# Altium project uStepperS.PrjPcb
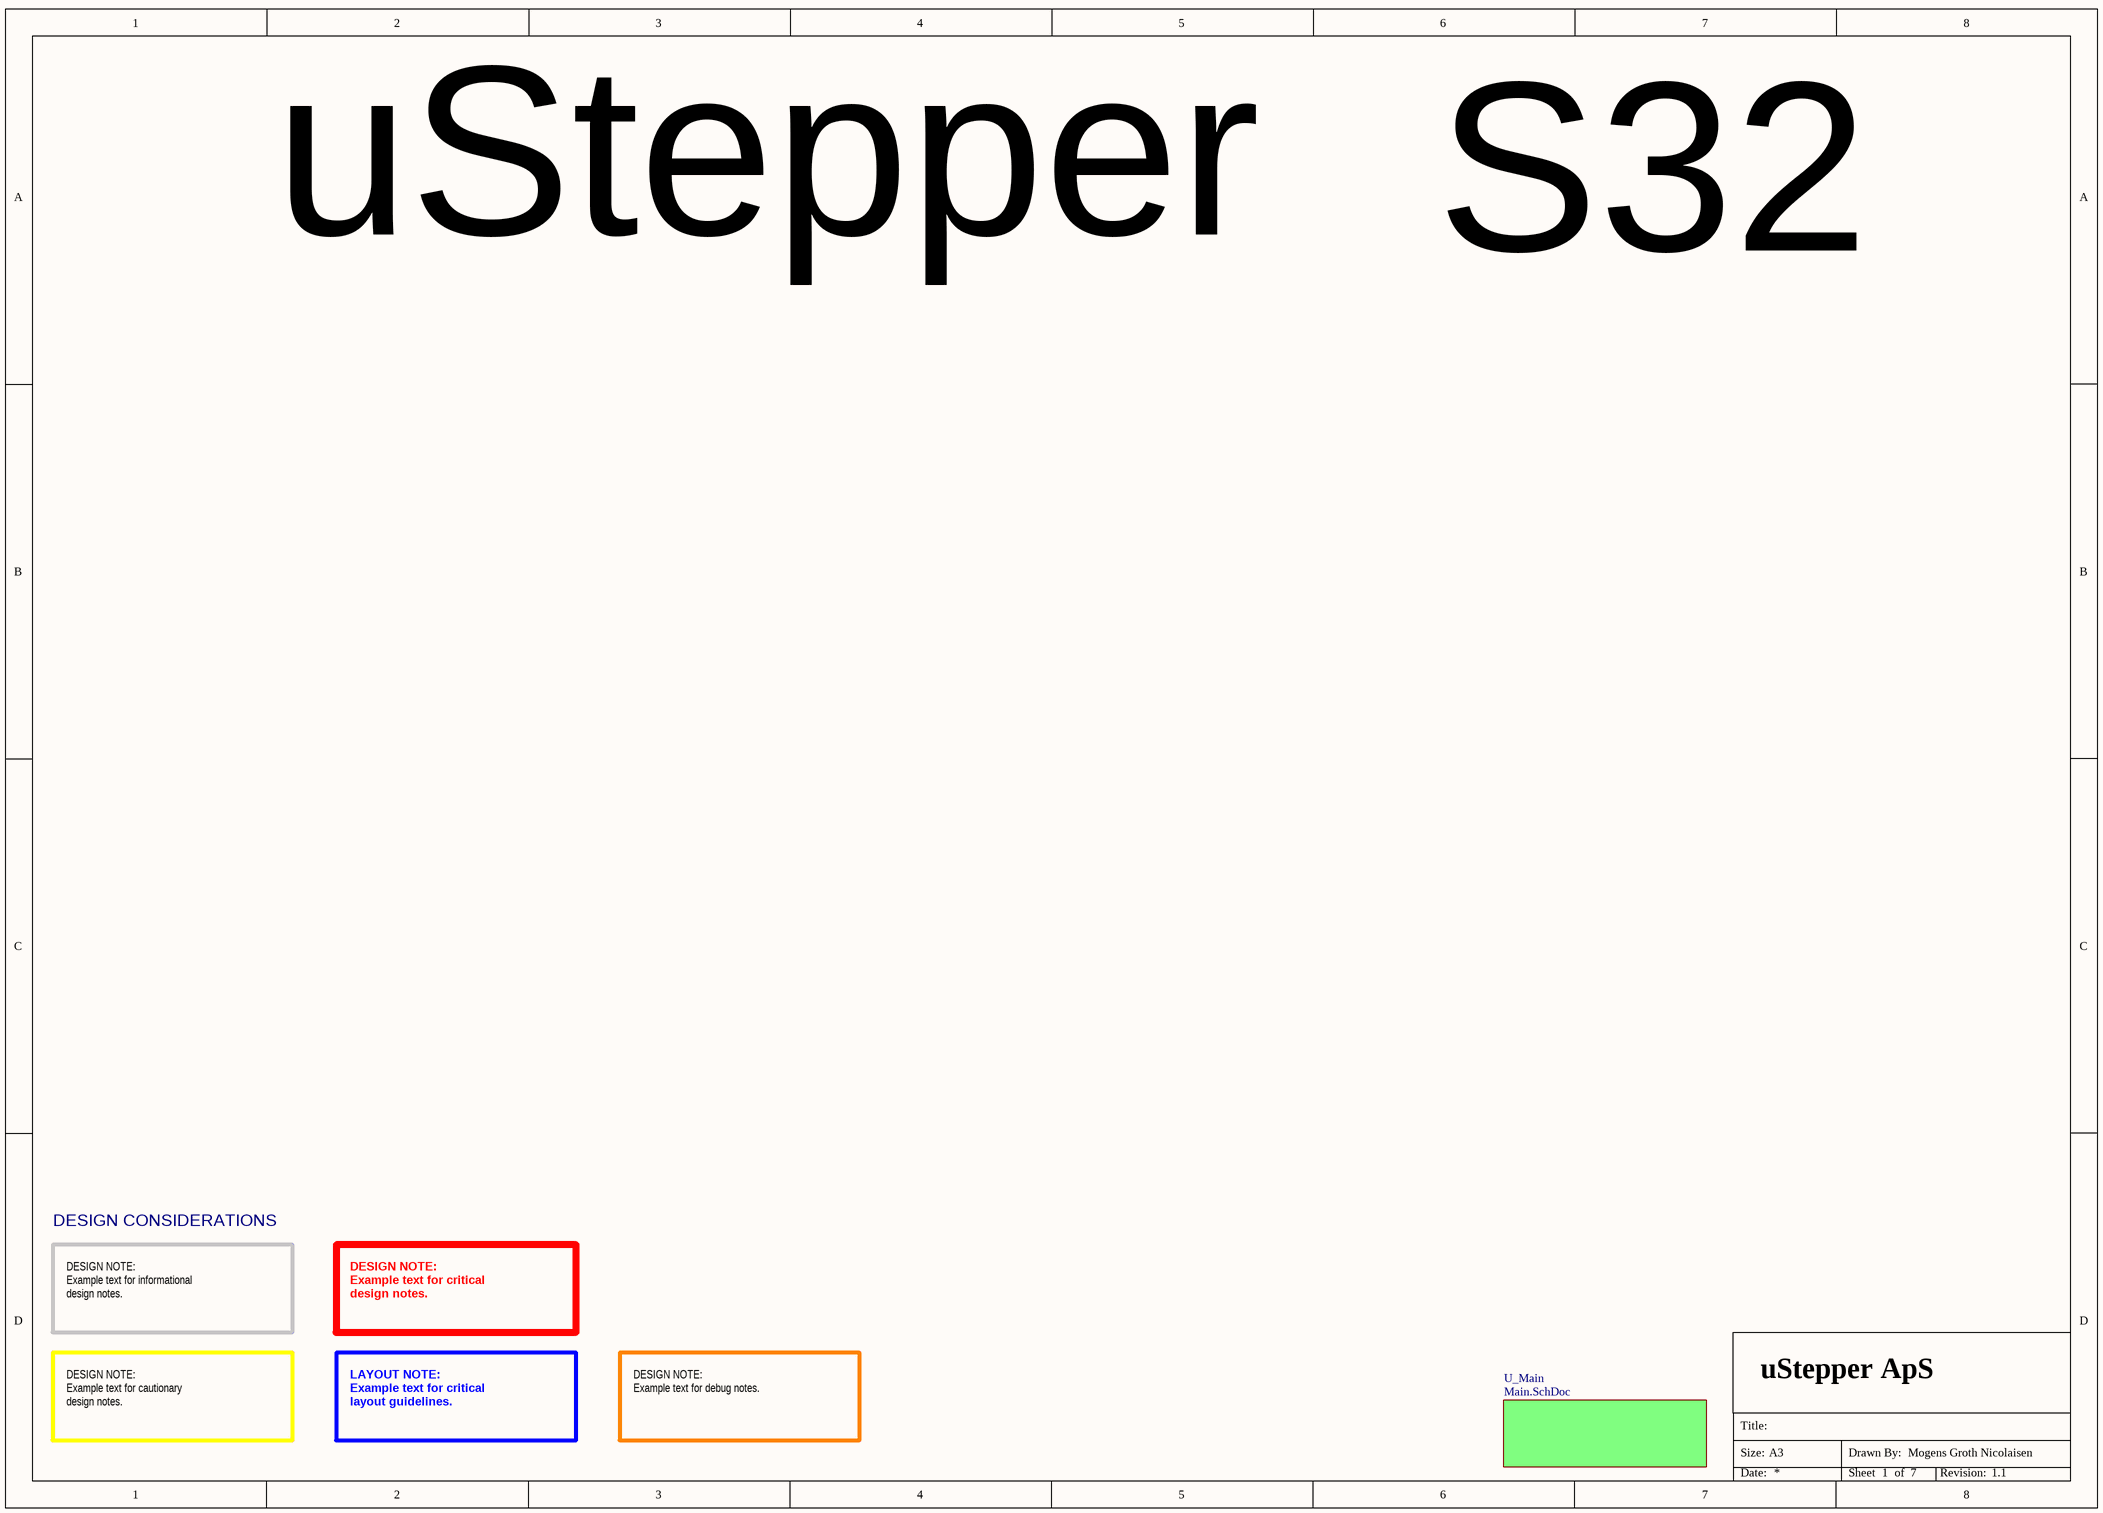
[diagram p0: Coverpage.SchDoc]
GlobalProjectRevision: 1.1; GlobalProjectName: uStepper S32; GlobalDrawnBy: Mogens Groth Nicolaisen; GlobalCompanyName: uStepper ApS
6 sheets, 134 parts. Net scope: hierarchical (ports join the sheet entries above them; power ports are global).
Board file: uStepper.PcbDoc
Sheets:
  Coverpage.SchDoc
    U_Main = Main.SchDoc
      U_encoder = encoder.SchDoc
      U_Power = Power.SchDoc
      U_Stepper_control = Stepper_control.SchDoc
      U_MCU+IO = MCU+IO.SchDoc

## Sheet Coverpage.SchDoc: =GlobalProjectName
size A3; DrawnBy: Mogens Groth Nicolaisen; DocumentNumber: 1; SheetNumber: 1; SheetTotal: 7

### Sub-sheets
U_Main = Main.SchDoc: no entries

### Notes on the sheet
- uStepper
- S32
- DESIGN CONSIDERATIONS
- DESIGN NOTE:
  Example text for informational
  design notes.
- DESIGN NOTE:
  Example text for critical
  design notes.
- DESIGN NOTE:
  Example text for cautionary
  design notes.
- LAYOUT NOTE:
  Example text for critical
  layout guidelines.
- DESIGN NOTE:
  Example text for debug notes.
- Title:
- Size:
- A3
- Drawn By:
- Date:
- Sheet
- of
- Revision:

## Sheet Main.SchDoc: Main
size A3; CompanyName: uStepper ApS; DrawnBy: Mogens Groth Nicolaisen; DocumentNumber: 2; Revision: 1.1; SheetNumber: 2; SheetTotal: 7
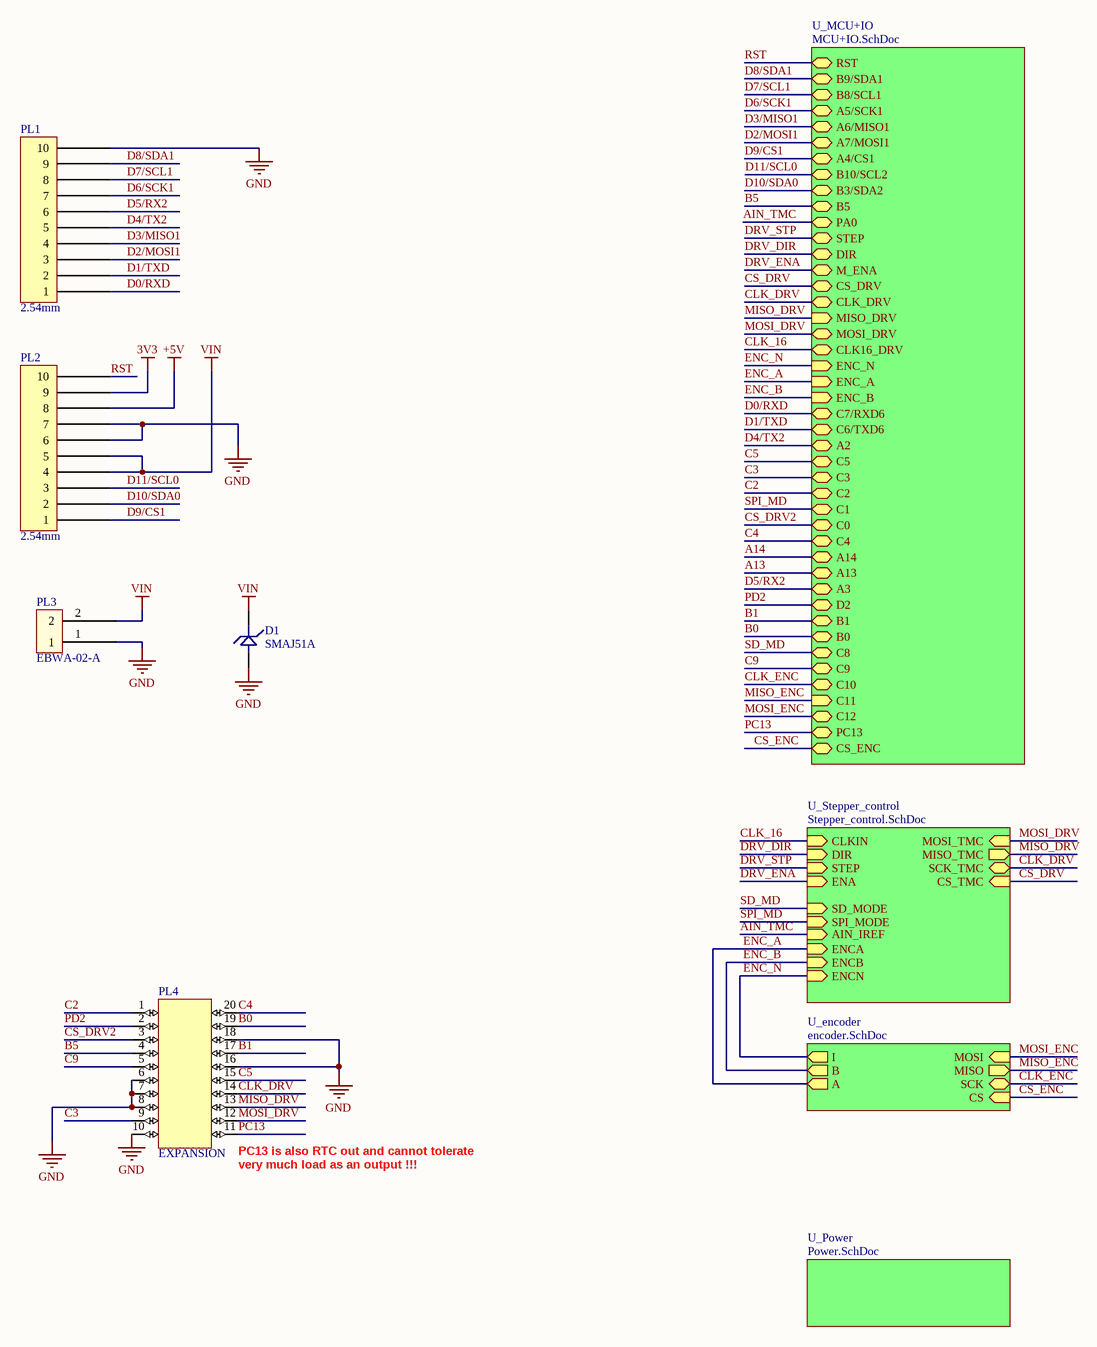
[diagram p1: Main.SchDoc]

### Parts
D1  SMAJ51A  [DIOM4227X23N]
PL1  2.54mm  [10-pin female 2.54mm]
PL2  2.54mm  [10-pin female 2.54mm]
PL3  EBWA-02-A  [691214110002]
PL4  EXPANSION  [20021121-00020T4LF-Footprint-1]

### Sub-sheets
U_encoder = encoder.SchDoc: MISO (out), MOSI (in), SCK (bidir), CS (in), A (out), B (out), I (out)
U_MCU+IO = MCU+IO.SchDoc: B9/SDA1 (bidir), B8/SCL1 (bidir), A5/SCK1 (bidir), A6/MISO1 (bidir), A7/MOSI1 (bidir), A4/CS1 (bidir), B10/SCL2 (bidir), B3/SDA2 (bidir), B5 (bidir), PA0 (bidir), STEP (bidir), DIR (bidir), M_ENA (bidir), CS_DRV (bidir), CLK_DRV (bidir), MISO_DRV (in), MOSI_DRV (bidir), CLK16_DRV (bidir), ENC_N (in), ENC_A (in), ENC_B (in), C7/RXD6 (bidir), C6/TXD6 (bidir), A2 (bidir), C5 (bidir), C3 (bidir), C2 (bidir), C1 (bidir), C0 (bidir), C4 (bidir), A14 (bidir), A13 (bidir), A3 (bidir), D2 (bidir), B1 (bidir), B0 (bidir), C8 (bidir), C9 (bidir), C10 (bidir), C11 (in), C12 (bidir), PC13 (bidir), CS_ENC (bidir), RST (bidir)
U_Power = Power.SchDoc: no entries
U_Stepper_control = Stepper_control.SchDoc: STEP (in), DIR (in), CS_TMC (in), SCK_TMC (bidir), MOSI_TMC (in), MISO_TMC (out), ENCN (in), ENCA (in), ENCB (in), SPI_MODE (in), SD_MODE (in), ENA (in), CLKIN (in), AIN_IREF (in)

### Nets
3V3: PL2.9
+5V: PL2.8
GND: D1.1 PL1.10 PL2.6 PL2.7 PL3.1 PL4.6 PL4.7 PL4.8 PL4.10 PL4.16 PL4.18
VIN: D1.3 PL2.4 PL2.5 PL3.2
AIN_TMC: sheet U_Stepper_control/AIN_IREF, sheet U_MCU+IO/PA0
B0: PL4.19 ; sheet U_MCU+IO/B0
B1: PL4.17 ; sheet U_MCU+IO/B1
B5: PL4.4 ; sheet U_MCU+IO/B5
C2: PL4.1 ; sheet U_MCU+IO/C2
C3: PL4.9 ; sheet U_MCU+IO/C3
C4: PL4.20 ; sheet U_MCU+IO/C4
C5: PL4.15 ; sheet U_MCU+IO/C5
C9: PL4.5 ; sheet U_MCU+IO/C9
CLK_16: sheet U_Stepper_control/CLKIN, sheet U_MCU+IO/CLK16_DRV
CLK_DRV: PL4.14 ; sheet U_Stepper_control/SCK_TMC, sheet U_MCU+IO/CLK_DRV
CLK_ENC: sheet U_encoder/SCK, sheet U_MCU+IO/C10
CS_DRV: sheet U_Stepper_control/CS_TMC, sheet U_MCU+IO/CS_DRV
CS_DRV2: PL4.3 ; sheet U_MCU+IO/C0
CS_ENC: sheet U_encoder/CS, sheet U_MCU+IO/CS_ENC
D0/RXD: PL1.1 ; sheet U_MCU+IO/C7/RXD6
D1/TXD: PL1.2 ; sheet U_MCU+IO/C6/TXD6
D2/MOSI1: PL1.3 ; sheet U_MCU+IO/A7/MOSI1
D3/MISO1: PL1.4 ; sheet U_MCU+IO/A6/MISO1
D4/TX2: PL1.5 ; sheet U_MCU+IO/A2
D5/RX2: PL1.6 ; sheet U_MCU+IO/A3
D6/SCK1: PL1.7 ; sheet U_MCU+IO/A5/SCK1
D7/SCL1: PL1.8 ; sheet U_MCU+IO/B8/SCL1
D8/SDA1: PL1.9 ; sheet U_MCU+IO/B9/SDA1
D9/CS1: PL2.1 ; sheet U_MCU+IO/A4/CS1
D10/SDA0: PL2.2 ; sheet U_MCU+IO/B3/SDA2
D11/SCL0: PL2.3 ; sheet U_MCU+IO/B10/SCL2
DRV_DIR: sheet U_Stepper_control/DIR, sheet U_MCU+IO/DIR
DRV_ENA: sheet U_Stepper_control/ENA, sheet U_MCU+IO/M_ENA
DRV_STP: sheet U_Stepper_control/STEP, sheet U_MCU+IO/STEP
ENC_A: sheet U_encoder/A, sheet U_Stepper_control/ENCA, sheet U_MCU+IO/ENC_A
ENC_B: sheet U_encoder/B, sheet U_Stepper_control/ENCB, sheet U_MCU+IO/ENC_B
ENC_N: sheet U_encoder/I, sheet U_Stepper_control/ENCN, sheet U_MCU+IO/ENC_N
MISO_DRV: PL4.13 ; sheet U_Stepper_control/MISO_TMC, sheet U_MCU+IO/MISO_DRV
MISO_ENC: sheet U_encoder/MISO, sheet U_MCU+IO/C11
MOSI_DRV: PL4.12 ; sheet U_Stepper_control/MOSI_TMC, sheet U_MCU+IO/MOSI_DRV
MOSI_ENC: sheet U_encoder/MOSI, sheet U_MCU+IO/C12
PC13: PL4.11 ; sheet U_MCU+IO/PC13
PD2: PL4.2 ; sheet U_MCU+IO/D2
RST: PL2.10 ; sheet U_MCU+IO/RST  [project net ~{RST}]
SD_MD: sheet U_Stepper_control/SD_MODE, sheet U_MCU+IO/C8
SPI_MD: sheet U_Stepper_control/SPI_MODE, sheet U_MCU+IO/C1

### Notes on the sheet
- (near PL4) PC13 is also RTC out and cannot tolerate very much load as an output !!!
- ON Development
- Title:
- Size:
- A3
- Drawn By:
- Date:
- Sheet
- of
- Revision:

### Library data of the parts
D1 = CMP-016-0017-0.2: Diode TVS Single Uni-Dir 51V 400W 2-Pin SMA; Direction: Unidirectional; Operating Supply Voltage: 3.5V; Max Surge Current: 40A; Reverse Breakdown Voltage: 56.7V; Breakdown Voltage: 62.7V; Number of Channels: 1; Clamping Voltage: 82.4V; Power Line Protection: No; Max Reverse Leakage Current: 5uA; Test Current: 1mA; Peak Pulse Current: 4.9A; Mount: Surface Mount; Case/Package: SMA; Number of Pins: 2; Min Operating Temperature: -55°C; Max Operating Temperature: 150°C; Packaging: Tape and Reel; Package Quantity: 1; Polarity: Unidirectional; Peak Pulse Power: 400W; Termination: SMD/SMT; Number of Unidirectional Channels: 1; Reverse Standoff Voltage: 51V; Min Breakdown Voltage: 56.7V; Number of Elements: 1; Element Configuration: Single; Leakage Current: 5uA; Composition: Zener; Radiation Hardening: No; Mfg. Part Number: SMAJ51A
PL1 PL2 = CMP-003-0004-2: Pin header 10-pin 2.54mm female; Mfg. Part Number: DS1023-1*10S21
PL3 = CMP-003-0031-0.0: Current: 10A; Wire gauge: 16-28 AWG; Mfg. Part Number: EBWA-02-A
PL4 = CMP-003-0038-0.0: Conn Unshrouded Header HDR 20 POS 1.27mm Solder ST Top Entry SMD Tube; Connector Type: Male Pin; Contact Resistance: 30mR; Current Rating: 20A; Gender: Male; Max Voltage Rating (AC): 125V; Number of Contacts: 20; Row Spacing: 0.05inch; Color: Black; Contact Material: Nickel; Contact Mating Length: 0.12inch; Contact Plating: Gold; Contact Type: Male Pin; Depth: 3.4mm; Housing Color: Black; Housing Material: Plastic; Length: 12.7mm; Max Operating Temperature: 85°C; Min Operating Temperature: -40°C; Mount: Surface Mount; Number of Positions: 20; Number of Rows: 2; Orientation: Straight; Package Quantity: 46; Packaging: Rail/Tube; Pitch: 1.27mm; RoHS Compliant: Yes; Series: Minitek 127® 20021121; Termination: Solder; Voltage Rating: 125V

## Sheet encoder.SchDoc: Encoder
size A3; DrawnBy: Mogens Groth Nicolaisen; DocumentNumber: 7; Revision: 1.1; SheetNumber: 7; SheetTotal: 7
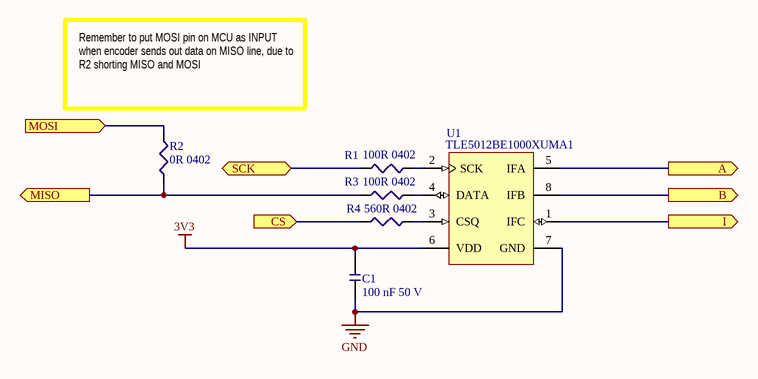
[diagram p2: encoder.SchDoc]

### Parts
C1  100 nF 50 V  [CAP_0402]
R1  100R 0402  [RES_0402]
R2  0R 0402  [RES_0402]
R3  560R 0402  [RES_0402]
R4  100R 0402  [RES_0402]
U1  TLE5012BE1000XUMA1  [INF-PG-DSO-8-16_M]

### Ports
A (out), B (out), CS (in), I (out), MISO (out), MOSI (in), SCK (bidir)

### Nets
3V3: C1.1 U1.6(VDD)
GND: C1.2 U1.7(GND)
CLK_ENC: R1.1 ; port SCK
CS_ENC: R4.1 ; port CS
ENC_A: U1.5(IFA) ; port A
ENC_B: U1.8(IFB) ; port B
ENC_N: U1.1(IFC) ; port I
MISO_ENC: R2.1 R3.1 ; port MISO
MOSI_ENC: R2.2 ; port MOSI
NetR1_2: R1.2 U1.2(SCK)
NetR3_2: R3.2 U1.4(DATA)
NetR4_2: R4.2 U1.3(CSQ)

### Notes on the sheet
- (near R2) Remember to put MOSI pin on MCU as INPUT when encoder sends out data on MISO line, due to R2 shorting MISO and MOSI
- ON Development
- Title:
- Size:
- A3
- Drawn By:
- Date:
- Sheet
- of
- Revision:

### Library data of the parts
C1 = CMP-00088-2: Multilayer Ceramic Capacitors MLCC - SMD/SMT .1uF 50Volts X7R +/-10% 0402 STD; Tolerance: 10%; Value: 100nF; Voltage: 50 V; Voltage Rating (DC): 50V; Capacitance: 100nF; Case/Package: 0402; Case Code (Imperial): 0402; Case Code (Metric): 1005; Dielectric: X7R; Halogen Free: Halogen Free; Height: 0.5mm; Lead Free: Lead Free; Length: 0.039inch; Max Operating Temperature: 125°C; Min Operating Temperature: -55°C; Mount: Surface Mount; Package Quantity: 10000; Packaging: Tape and Reel; Termination: SMD/SMT; Thickness: 0.022inch; Voltage Rating: 50V; Width: 0.5mm
R1 R4 = CMP-001-0001-5: 100R 1% 0402 63mW; Case/Package: 0402; Power: 63mW; Tolerance: 1%; Value: 100R
R2 = CMP-001-0055-1: RES SMD 0 OHM 1/16W 0402; Mfg. Part Number: RC0402JR-070RL; Power: 63mW; Case/Package: 0402; Tolerance: -; Value: 0R
R3 = CMP-001-0021-4: RES SMD 560 OHM 1% 1/16W 0402; Mfg. Part Number: RC1005F561CS; Case/Package: 0402; Power: 1/16 W; Tolerance: 1 %; Value: 560R
U1 = CMP-00121-2: Board Mount Hall Effect / Magnetic Sensors GMR Based Angle Sensor 6.5V; Operating Supply Voltage: 5V; Interface: SPI; Mount: Surface Mount; Case/Package: SMD/SMT; Number of Pins: 8; Min Operating Temperature: -40°C; Max Operating Temperature: 150°C; Lead Free: Lead Free; Halogen Free: Not Halogen Free

## Sheet Power.SchDoc: Power
size A3; DrawnBy: Mogens Groth Nicolaisen; DocumentNumber: 5; Revision: 1.1; SheetNumber: 5; SheetTotal: 7
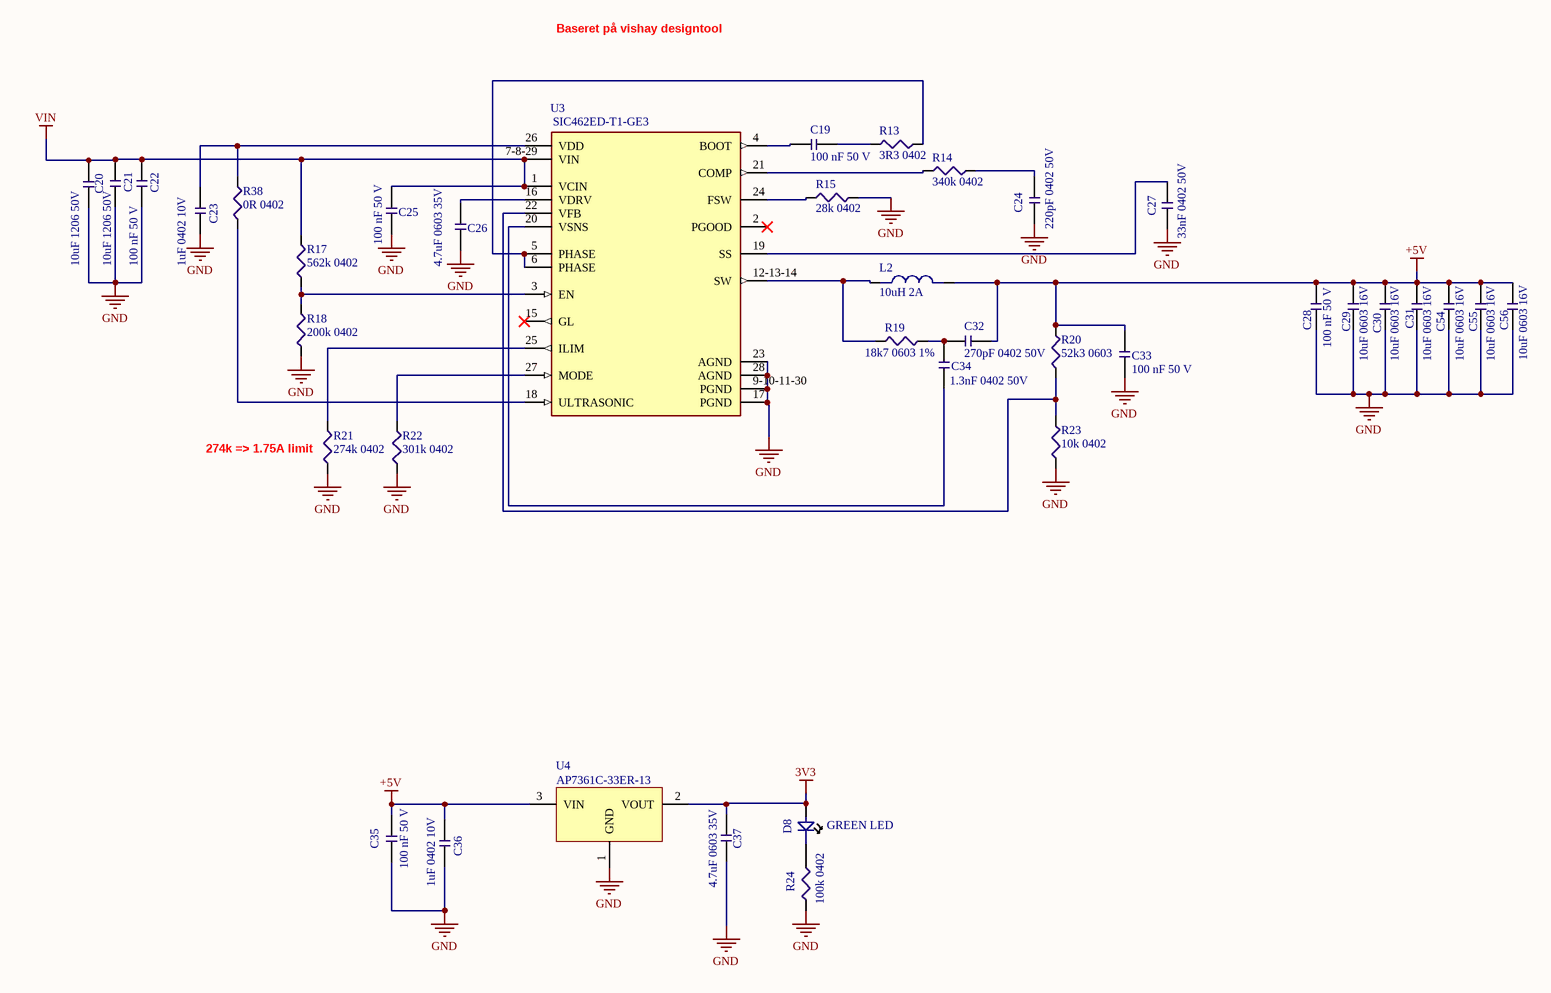
[diagram p3: Power.SchDoc]

### Parts
C19  100 nF 50 V  [CAP_0402]
C20  10uF 1206 50V  [CAP_1206]
C21  10uF 1206 50V  [CAP_1206]
C22  100 nF 50 V  [CAP_0402]
C23  1uF 0402 10V  [CAP_0402]
C24  220pF 0402 50V  [CAP_0402]
C25  100 nF 50 V  [CAP_0402]
C26  4.7uF 0603 35V  [CAP_0603]
C27  33nF 0402 50V  [CAP_0402]
C28  100 nF 50 V  [CAP_0402]
C29  10uF 0603 16V  [CAP_0603]
C30  10uF 0603 16V  [CAP_0603]
C31  10uF 0603 16V  [CAP_0603]
C32  270pF 0402 50V  [CAP_0402]
C33  100 nF 50 V  [CAP_0402]
C34  1.3nF 0402 50V  [CAP_0402]
C35  100 nF 50 V  [CAP_0402]
C36  1uF 0402 10V  [CAP_0402]
C37  4.7uF 0603 35V  [CAP_0603]
C54  10uF 0603 16V  [CAP_0603]
C55  10uF 0603 16V  [CAP_0603]
C56  10uF 0603 16V  [CAP_0603]
D8  GREEN LED  [0402 LED]
L2  10uH 2A  [FP-NR5040-H_4_1-MFG]
R13  3R3 0402  [RES_0402]
R14  340k 0402  [RES_0402]
R15  28k 0402  [RES_0402]
R17  562k 0402  [RES_0402]
R18  200k 0402  [RES_0402]
R19  18k7 0603 1%  [RES_0603]
R20  52k3 0603  [RES_0603]
R21  274k 0402  [RES_0402]
R22  301k 0402  [RES_0402]
R23  10k 0402  [RES_0402]
R24  100k 0402  [RES_0402]
R38  0R 0402  [RES_0402]
U3  SIC462ED-T1-GE3  [FP-T18-0594-MFG]
U4  AP7361C-33ER-13  [SOT230P700X180-4N]

### Nets
3V3: C37.2 D8.1 U4.2(VOUT)
+5V: C28.2 C29.2 C30.2 C31.2 C32.2 C33.2 C35.2 C36.2 C54.2 C55.2 C56.2 L2.2 R20.2 U4.3(VIN)
GND: C20.2 C21.2 C22.1 C23.1 C24.1 C25.1 C26.1 C27.1 C28.1 C29.1 C30.1 C31.1 C33.1 C35.1 C36.1 C37.1 C54.1 C55.1 C56.1 R15.2 R18.1 R21.1 R22.1 R23.1 R24.1 U3.9-10-11-30(PGND) U3.17(PGND) U3.23(AGND) U3.28(AGND) U4.1(GND)
VIN: C20.1 C21.1 C22.2 C25.2 R17.2 U3.1(VCIN) U3.7-8-29(VIN)
NetC19_1: C19.1 U3.4(BOOT)
NetC19_2: C19.2 R13.1
NetC23_2: C23.2 R38.2 U3.26(VDD)
NetC24_2: C24.2 R14.2
NetC26_2: C26.2 U3.16(VDRV)
NetC27_2: C27.2 U3.19(SS)
NetC32_1: C32.1 C34.2 R19.2
NetC34_1: C34.1 U3.20(VSNS)
NetD8_2: D8.2 R24.2
NetL2_1: L2.1 R19.1 U3.12-13-14(SW)
NetR13_2: R13.2 U3.5(PHASE) U3.6(PHASE)
NetR14_1: R14.1 U3.21(COMP)
NetR15_1: R15.1 U3.24(FSW)
NetR17_1: R17.1 R18.2 U3.3(EN)
NetR20_1: R20.1 R23.2 U3.22(VFB)
NetR21_2: R21.2 U3.25(ILIM)
NetR22_2: R22.2 U3.27(MODE)
NetR38_1: R38.1 U3.18(ULTRASONIC)

Not connected (* = marked no-connect by the designer): U3 2(PGOOD)* 15(GL)*

### Notes on the sheet
- Baseret på vishay designtool
- 274k => 1.75A limit
- ON Development
- Title:
- Size:
- A3
- Drawn By:
- Date:
- Sheet
- of
- Revision:

### Library data of the parts
C19 C22 C25 C28 C33 C35 = CMP-00088-2: Multilayer Ceramic Capacitors MLCC - SMD/SMT .1uF 50Volts X7R +/-10% 0402 STD; Tolerance: 10%; Value: 100nF; Voltage: 50 V; Voltage Rating: 50V; Mount: Surface Mount; Case/Package: 0402; Case Code (Imperial): 0402; Case Code (Metric): 1005; Min Operating Temperature: -55°C; Max Operating Temperature: 125°C; Capacitance: 100nF; Voltage Rating (DC): 50V; Packaging: Tape and Reel; Package Quantity: 10000; Dielectric: X7R; Termination: SMD/SMT; Length: 0.039inch; Height: 0.5mm; Width: 0.5mm; Thickness: 0.022inch; Lead Free: Lead Free; Halogen Free: Halogen Free
C20 C21 = CMP-00030-4: 10uF 1206 50V X5R 20%; Tolerance: +/- 20%; Value: 10uF; Voltage: 50 V
C23 C36 = CMP-00032-5: 1uF 0402 10V 10% X5R; Material: Ceramic; Tolerance: 10%; Value: 1 uF; Voltage: 10 V; Capacitance: 1uF; Case/Package: 0402; Case Code (Imperial): 0402; Case Code (Metric): 1005; Contact Plating: Tin; Depth: 0.5mm; Dielectric: X5R; Height: 0.5mm; Length: 1mm; Max Operating Temperature: 85°C; Min Operating Temperature: -55°C; Mount: Surface Mount; Package Quantity: 1; Packaging: Tape and Reel; Radiation Hardening: No; Thickness: 0.022inch; Voltage Rating: 10V; Width: 0.02inch
C24 = CMP-00170-1: 220pF 0402 50V 5%; Mfg. Part Number: CL05C221JB5NNNC; Tolerance: 5%; Value: 220pF; Voltage: 50V
C26 C37 = CMP-00134-0.1: CAPACITOR CERAMIC, 4.7UF, 35V, X5R, 10%, 0603; Capacitance: 4.7µF; Capacitance Tolerance: ± 10%; Dielectric...; Tolerance: 10%; Capacitance: 4.7uF; Case/Package: 0603; Case Code (Imperial): 0603; Case Code (Metric): 1608; Max Operating Temperature: 85°C; Min Operating Temperature: -55°C; Packaging: Tape and Reel; Series: C; Termination: SMD/SMT; Voltage Rating: 35V
C27 = CMP-00171-2: 33nF 0402 50V X7R 10%; Manufacturer part no.: GRM155R61H333KE14D; Tolerance: 10%; Value: 33nF; Voltage: 50V
C29-C31 C54-C56 = CMP-00120-1: CAP CER 10UF 16V X5R 0603; Tolerance: 10%; Value: 10uF; Voltage: 16V; Mount: Surface Mount; Case/Package: 0603; Weight: 0.000222oz; Case Code (Metric): 1608; Case Code (Imperial): 0603; Min Operating Temperature: -55°C; Max Operating Temperature: 85°C; Capacitance: 10uF; Packaging: Tape and Reel; Voltage Rating: 16V; Dielectric: X5R; Termination: SMD/SMT; Composition: Ceramic; Voltage Rating (DC): 16V; Package Quantity: 4000; Length: 0.063inch; Height: 0.8mm; Width: 0.8mm; Thickness: 0.037inch; REACH SVHC: No SVHC; Lead Free: Lead Free
C32 = CMP-00175-1: Multilayer Ceramic Capacitors MLCC - SMD/SMT Midhigh 0402 C0G 50V 270pF 5%; Mfg. Part Number: UMK105CG271JV-F; Tolerance: 5%; Value: 270pF; Voltage: 50V
C34 = CMP-00174-1: Cap Ceramic 0.0013uF 50V C0G 5% SMD 0402 125°C Paper T/R; Manufacturer Part no.: C0402C132J5GAC7867; Tolerance: 10%; Value: 1.3nF; Voltage: 50V
D8 = CMP-008-0001-2: 0402 SMD LED; Mfg. Part Number: LTST-C281KGKT
L2 = CMP-007-0013-1: Inductor Power Shielded Wirewound 10uH 20% 100KHz Ferrite 2.1A 0.0728Ohm DCR T/R; Mfg. Part No: NRS5040T100MMGJ; Current: 2.2A; Value: 10 uH; Case/Package: Nonstandard
R13 = CMP-001-0062-1: RES SMD 3R3 OHM 1% 1/16W 0402; Mfg. Part Number: CRGCQ0402J3R3; Tolerance: 5%; Case/Package: 0402; Power: 1/16 W; Value: 3R3
R14 = CMP-001-0058-1: RES SMD 340K OHM 1% 1/16W 0402; Mfg. Part Number: RC0402FR-07340KL; Case/Package: 0402; Power: 1/16 W; Tolerance: 1%; Value: 340k
R15 = CMP-0001-00014-1: 28K 0402 1% 1/16W; Resistance: 28kR; Max Power Dissipation: 63mW; Temperature Coefficient: 100ppm/°C; Case/Package: 0402; Power: 1/16W; Tolerance: 1%; Value: 28K; Mount: Surface Mount; Case Code (Metric): 1005; Case Code (Imperial): 0402; Contact Plating: Tin, Matte; Min Operating Temperature: -55°C; Max Operating Temperature: 155°C; Packaging: Tape and Reel; Composition: Thick Film; Number of Terminations: 2; Features: Automotive AEC-Q200; Length: 0.039inch; Height: 0.016inch; Width: 0.02inch; Radiation Hardening: No; Lead Free: Lead Free
R17 = CMP-001-0061-1: RES SMD 562K OHM 1% 1/16W 0402; Mfg. Part Number: RMCF0402FT562K; Case/Package: 0402; Power: 1/16 W; Tolerance: 1%; Value: 562k
R18 = CMP-001-0060-1: RES SMD 200K OHM 1% 1/16W 0402; Mfg. Part Number: RC1005F204CS; Case/Package: 0402; Power: 1/16 W; Tolerance: 1%; Value: 200k
R19 = CMP-001-0068-1: Res Thick Film 0603 18.7K Ohm 1% 1/10W ±100ppm/°C Molded SMD SMD Paper T/R; Manufacturer part no.: RMCF0603FT18K7; Case/Package: 0603; Tolerance: 1%; Value: 18k7
R20 = CMP-001-0064-2: Res Thick Film 0603 52.3K Ohm 1% 0.1W(1/10W) ±100ppm/C Epoxy SMD T/R; Manufacturer Part no.: RC0603FR-0752K3L; Value: 52.6k; Case/Package: 0603; Power: 1/10W; Tolerance: 1%
R21 = CMP-001-0066-1: Res Thick Film 0402 274K Ohm 1% 0.063W ±100ppm/°C Molded SMD Paper T/R; Mfg. Part Number: RMCF0402FT274K; Power: 63mW; Case/Package: 0402; Tolerance: 1%; Value: 274k
R22 = CMP-0001-00033-1: 301K 1% 0402; Manufacturer part no.: RMCF0402FT301K; Value: 301kOhm; Case/Package: 0402; Tolerance: 1%
R23 = CMP-001-0019-3: RES SMD 10K OHM 1% 1/16W 0402; Mfg. Part Number: RMCF0402FT10K0; Case/Package: 0402; Power: 1/16 W; Tolerance: 1 %; Value: 10k
R24 = CMP-00123-1: Res General Purpose Thick Film 0402 100K Ohm 1% 1/16W ±100ppm/°C Molded SMD Paper T/R; Mfg. Part Number: RC0402FR-07100KL; Voltage: 50V; Power Rating: 63mW; Resistance: 100kR; Tolerance: 1%; Value: 100k; Case/Package: 0402; Case Code (Metric): 1005; Case Code (Imperial): 0402; Min Operating Temperature: -55°C; Max Operating Temperature: 155°C; Voltage Rating: 50V; Package Quantity: 1; Packaging: Tape and Reel; Composition: Thick Film; Number of Terminations: 2; Termination: SMD/SMT; Temperature Coefficient: 100ppm/°C; Military Standard: Not; Max Power Dissipation: 63mW; Working Voltage: 50V; Features: Moisture Resistant; Length: 0.039inch; Height: 0.016inch; Width: 0.02inch; Depth: 0.5mm; REACH SVHC: No SVHC; Lead Free: Lead Free
R38 = CMP-001-0055-1: as R2 on sheet encoder; Case/Package: 0402; Tolerance: -; Value: 0R
U3 = CMP-00167-1: SiC462 Series 60 V 6 A Synchronous Buck Regulator - PowerPAK® MLP55-27; manufacturer part no.: SIC462ED-T1-GE3
U4 = CMP-00179-1: 1A Low Dropout 3V3; Mount: SMD; Case/Package: SOT223R; Manufacturer Part No.:: AP7361C-33ER-13; Pins: 4; RoHS: Yes

## Sheet Stepper_control.SchDoc: Stepper Control
size A3; DrawnBy: Mogens Groth Nicolaisen; DocumentNumber: 4; Revision: 1.1; SheetNumber: 4; SheetTotal: 7
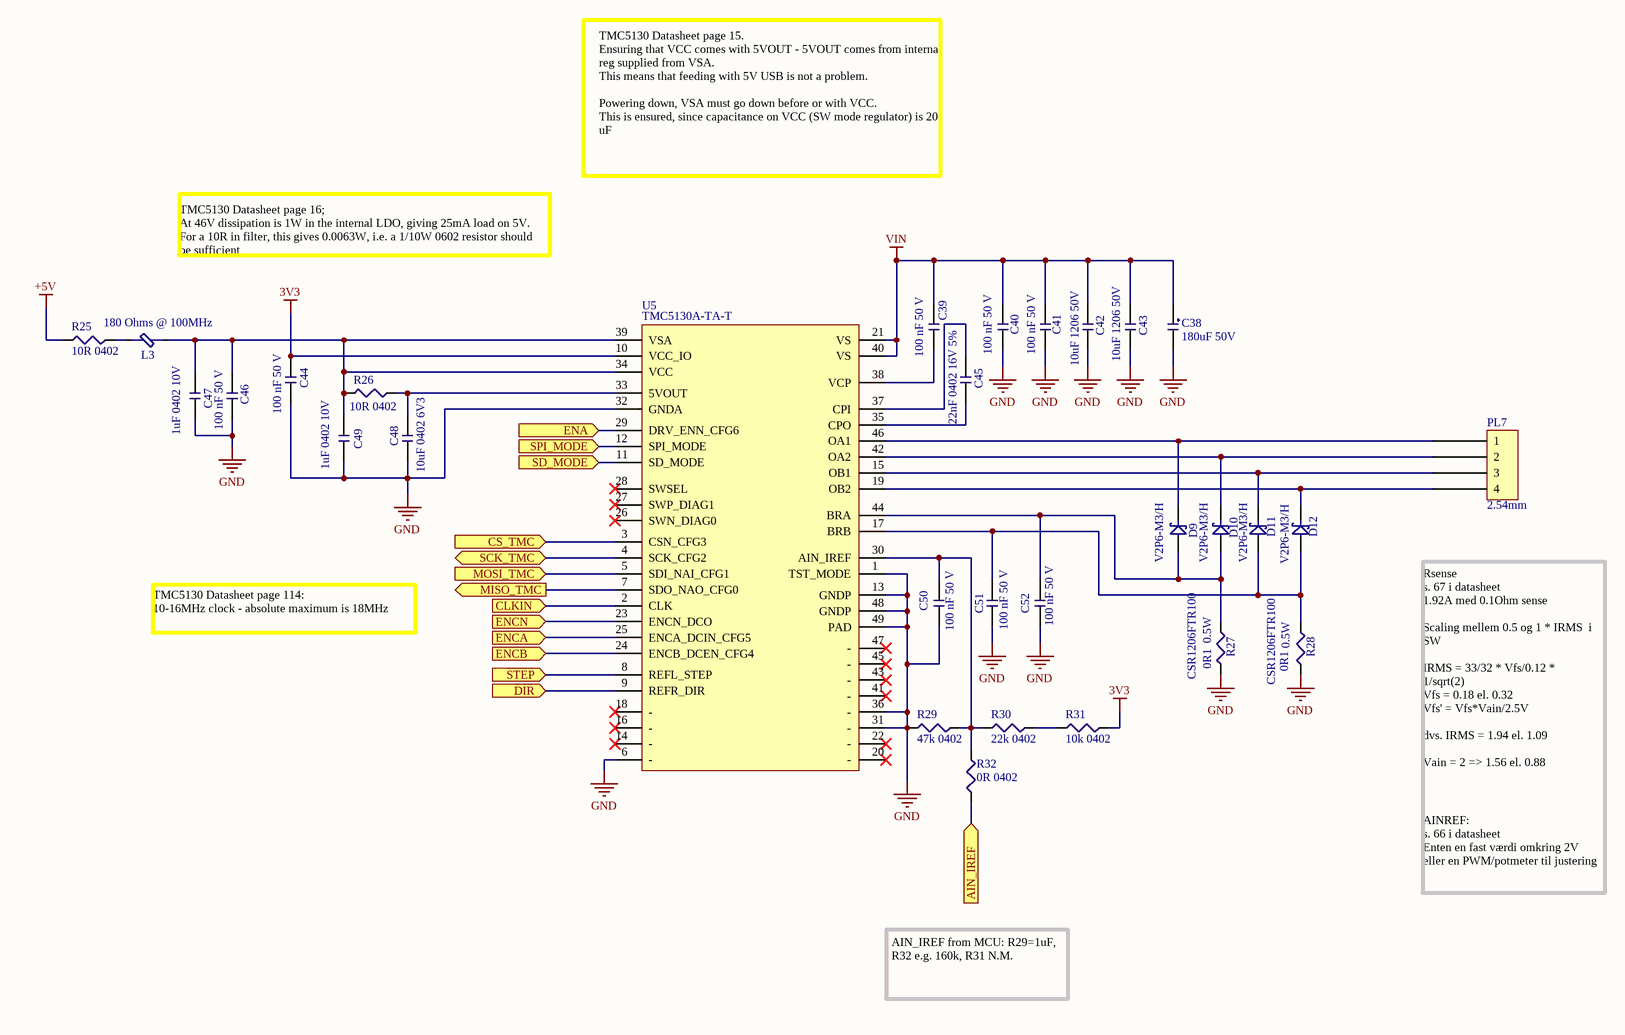
[diagram p4: Stepper_control.SchDoc]

### Parts
C38  180uF 50V  [Capacitor 8x22]
C39  100 nF 50 V  [CAP_0402]
C40  100 nF 50 V  [CAP_0402]
C41  100 nF 50 V  [CAP_0402]
C42  10uF 1206 50V  [CAP_1206]
C43  10uF 1206 50V  [CAP_1206]
C44  100 nF 50 V  [CAP_0402]
C45  22nF 0402 16V 5%  [CAP_0402]
C46  100 nF 50 V  [CAP_0402]
C47  1uF 0402 10V  [CAP_0402]
C48  10uF 0402 6V3  [CAP_0402]
C49  1uF 0402 10V  [CAP_0402]
C50  100 nF 50 V  [CAP_0402]
C51  100 nF 50 V  [CAP_0402]
C52  100 nF 50 V  [CAP_0402]
D9  V2P6-M3/H  [MicroSMP]
D10  V2P6-M3/H  [MicroSMP]
D11  V2P6-M3/H  [MicroSMP]
D12  V2P6-M3/H  [MicroSMP]
L3  180 Ohms @ 100MHz  [IND_0603]
PL7  2.54mm  [4-pin 2.54mm header]
R25  10R 0402  [RES_0402]
R26  10R 0402  [RES_0402]
R27  CSR1206FTR100  value 0R1  Power: 0.5W  [RES_1206]
R28  CSR1206FTR100  value 0R1  Power: 0.5W  [RES_1206]
R29  47k 0402  [RES_0402]
R30  22k 0402  [RES_0402]
R31  10k 0402  [RES_0402]
R32  0R 0402  [RES_0402]
U5  TMC5130A-TA-T  [TSQFP50P900X900X120_HS-49N]

### Ports
AIN_IREF (in), CLKIN (in), CS_TMC (in), DIR (in), ENA (in), ENCA (in), ENCB (in), ENCN (in), MISO_TMC (out), MOSI_TMC (in), SCK_TMC (bidir), SD_MODE (in), SPI_MODE (in), STEP (in)

### Nets
3V3: C44.1 R31.1 U5.10(VCC_IO)
+5V: R25.2
GND: C38.2 C40.2 C41.2 C42.2 C43.2 C44.2 C46.2 C47.1 C48.1 C49.1 C50.2 C51.2 C52.2 R27.1 R28.1 R29.2 U5.1(TST_MODE) U5.6(-) U5.13(GNDP) U5.31(-) U5.32(GNDA) U5.36(-) U5.48(GNDP) U5.49(PAD)
VIN: C38.1 C39.2 C40.1 C41.1 C42.1 C43.1 U5.21(VS) U5.40(VS)
AIN_TMC: R32.1 ; port AIN_IREF
CLK_16: U5.2(CLK) ; port CLKIN
CLK_DRV: U5.4(SCK_CFG2) ; port SCK_TMC
CS_DRV: U5.3(CSN_CFG3) ; port CS_TMC
DRV_DIR: U5.9(REFR_DIR) ; port DIR
DRV_ENA: U5.29(DRV_ENN_CFG6) ; port ENA
DRV_STP: U5.8(REFL_STEP) ; port STEP
ENC_A: U5.25(ENCA_DCIN_CFG5) ; port ENCA
ENC_B: U5.24(ENCB_DCEN_CFG4) ; port ENCB
ENC_N: U5.23(ENCN_DCO) ; port ENCN
MISO_DRV: U5.7(SDO_NAO_CFG0) ; port MISO_TMC
MOSI_DRV: U5.5(SDI_NAI_CFG1) ; port MOSI_TMC
SD_MD: U5.11(SD_MODE) ; port SD_MODE
SPI_MD: U5.12(SPI_MODE) ; port SPI_MODE
NetC39_1: C39.1 U5.38(VCP)
NetC45_1: C45.1 U5.35(CPO)
NetC45_2: C45.2 U5.37(CPI)
NetC46_1: C46.1 C47.2 C49.2 L3.2 R26.1 U5.34(VCC) U5.39(VSA)
NetC48_2: C48.2 R26.2 U5.33(5VOUT)
NetC50_1: C50.1 R29.1 R30.1 R32.2 U5.30(AIN_IREF)
NetC51_1: C51.1 D11.1 D12.1 R28.2 U5.17(BRB)
NetC52_1: C52.1 D9.1 D10.1 R27.2 U5.44(BRA)
NetD9_2: D9.2 PL7.1 U5.46(OA1)
NetD10_2: D10.2 PL7.2 U5.42(OA2)
NetD11_2: D11.2 PL7.3 U5.15(OB1)
NetD12_2: D12.2 PL7.4 U5.19(OB2)
NetL3_1: L3.1 R25.1
NetR30_2: R30.2 R31.2

Not connected (* = marked no-connect by the designer): U5 14(-)* 16(-)* 18(-)* 20(-)* 22(-)* 26(SWN_DIAG0)* 27(SWP_DIAG1)* 28(SWSEL)* 41(-)* 43(-)* 45(-)* 47(-)*

### Notes on the sheet
- TMC5130 Datasheet page 15.
  Ensuring that VCC comes with 5VOUT - 5VOUT comes from internal reg supplied from VSA.
  This means that feeding with 5V USB is not a problem.
  Powering down, VSA must go down before or with VCC.
  This is ensured, since capacitance on VCC (SW mode regulator) is 20 uF
- TMC5130 Datasheet page 16;
  At 46V dissipation is 1W in the internal LDO, giving 25mA load on 5V.
  For a 10R in filter, this gives 0.0063W, i.e. a 1/10W 0602 resistor should be sufficient
- TMC5130 Datasheet page 114:
  10-16MHz clock - absolute maximum is 18MHz
- Rsense
  s. 67 i datasheet
  1.92A med 0.1Ohm sense
  Scaling mellem 0.5 og 1 * IRMS  i SW
  IRMS = 33/32 * Vfs/0.12 * 1/sqrt(2)
  Vfs = 0.18 el. 0.32
  Vfs' = Vfs*Vain/2.5V
  dvs. IRMS = 1.94 el. 1.09
  Vain = 2 => 1.56 el. 0.88
- AINREF:
  s. 66 i datasheet
  Enten en fast værdi omkring 2V eller en PWM/potmeter til justering
- AIN_IREF from MCU: R29=1uF, R32 e.g. 160k, R31 N.M.
- ON Development
- Title:
- Size:
- A3
- Drawn By:
- Date:
- Sheet
- of
- Revision:

### Library data of the parts
C38 = CMP-002-0003-4: 180UF 20% 50V 105DEG RADIAL; Case/Package: -; Tolerance: 20%; Value: 180uF
C39-C41 C44 C46 C50 = CMP-00088-2: as C19 on sheet Power; Mount: Surface Mount; Case/Package: 0402; Case Code (Imperial): 0402; Case Code (Metric): 1005; Min Operating Temperature: -55°C; Max Operating Temperature: 125°C; Capacitance: 100nF; Voltage Rating (DC): 50V; Packaging: Tape and Reel; Package Quantity: 10000; Dielectric: X7R; Termination: SMD/SMT; Length: 0.039inch; Height: 0.5mm; Width: 0.5mm; Thickness: 0.022inch; Lead Free: Lead Free; Halogen Free: Halogen Free
C42 C43 = CMP-00030-4: as C20 on sheet Power; Value: 10uF; Voltage: 50 V
C45 = CMP-00176-1: 22nF 0402 16V X7R 5%; Mfg. Part Number: GRM155R71C223JA01D; Tolerance: 5%; Value: 22nF; Voltage: 16V
C47 C49 = CMP-00032-5: 1uF 0402 10V 10% X5R; Material: Ceramic; Tolerance: 10%; Value: 1 uF; Voltage: 10 V; Capacitance: 1uF; Case/Package: 0402; Case Code (Imperial): 0402; Case Code (Metric): 1005; Contact Plating: Tin; Depth: 0.5mm; Dielectric: X5R; Height: 0.5mm; Length: 1mm; Max Operating Temperature: 85°C; Min Operating Temperature: -55°C; Mount: Surface Mount; Package Quantity: 1; Packaging: Tape and Reel; Radiation Hardening: No; Thickness: 0.022inch; Voltage Rating: 10V; Width: 0.02inch
C48 = CMP-00011-3: 10uF 20% 0402 6V3 X6S; Current Rating: -; Tolerance: 20%; Value: 10uF; Voltage: 6V3
C51 C52 = CMP-00088-2: as C1 on sheet encoder; Capacitance: 100nF; Case/Package: 0402; Case Code (Imperial): 0402; Case Code (Metric): 1005; Dielectric: X7R; Halogen Free: Halogen Free; Height: 0.5mm; Lead Free: Lead Free; Length: 0.039inch; Max Operating Temperature: 125°C; Min Operating Temperature: -55°C; Mount: Surface Mount; Package Quantity: 10000; Packaging: Tape and Reel; Termination: SMD/SMT; Thickness: 0.022inch; Voltage Rating: 50V; Width: 0.5mm
D9-D12 = CMP-016-0002-2: DIODE SCHOTTKY 60V 2A MICROSMP
L3 = CMP-ROOT-0005-2: FERRITE BEAD 180 OHM 0603 1LN; Mfg. Part Number: BLM18PG181SN1D; Current: 1.5A; Value: 180 Ohm; Case/Package: 0603
PL7 = CMP-003-0003-3: Pin header 4-pin 2.54mm male; Mfg. Part Number: DS1021-1*4SF1-1
R25 R26 = CMP-001-0033-3: RES SMD 10 OHM 1% 1/16W 0402; Mfg. Part Number: 0402WGF100JTCE; Power: 63mW; Case/Package: 0402; Tolerance: 1%; Value: 10R
R27 R28 = CMP-001-0024-3: RES 0.1 OHM 1% 1/2W 1206; Case/Package: 1206; Tolerance: 1%; Mfg. Part Number: CSR1206FTR100
R29 = CMP-001-0027-3: RES SMD 47K OHM 1% 1/16W 0402; Mfg. Part Number: RMCF0402FT47K0; Case/Package: 0402; Power: 1/16W; Tolerance: 1%; Value: 47k
R30 = CMP-001-0026-3: RES SMD 22K OHM 1% 1/16W 0402; Mfg. Part Number: RMCF0402FT22K0; Case/Package: 0402; Power: 1/16W; Tolerance: 1%; Value: 22k
R31 = CMP-001-0019-3: as R23 on sheet Power; Case/Package: 0402; Power: 1/16 W; Tolerance: 1 %; Value: 10k
R32 = CMP-001-0055-1: as R2 on sheet encoder; Case/Package: 0402; Tolerance: -; Value: 0R
U5 = CMP-00034-3: IC MOTOR CTLR/DVR SPI 48QFP; Mfg. Part Number: TMC5130A-TA-T

## Sheet MCU+IO.SchDoc: MCU
size A3; DrawnBy: Mogens Groth Nicolaisen; DocumentNumber: 3; Revision: 1.1; SheetNumber: 3; SheetTotal: 7
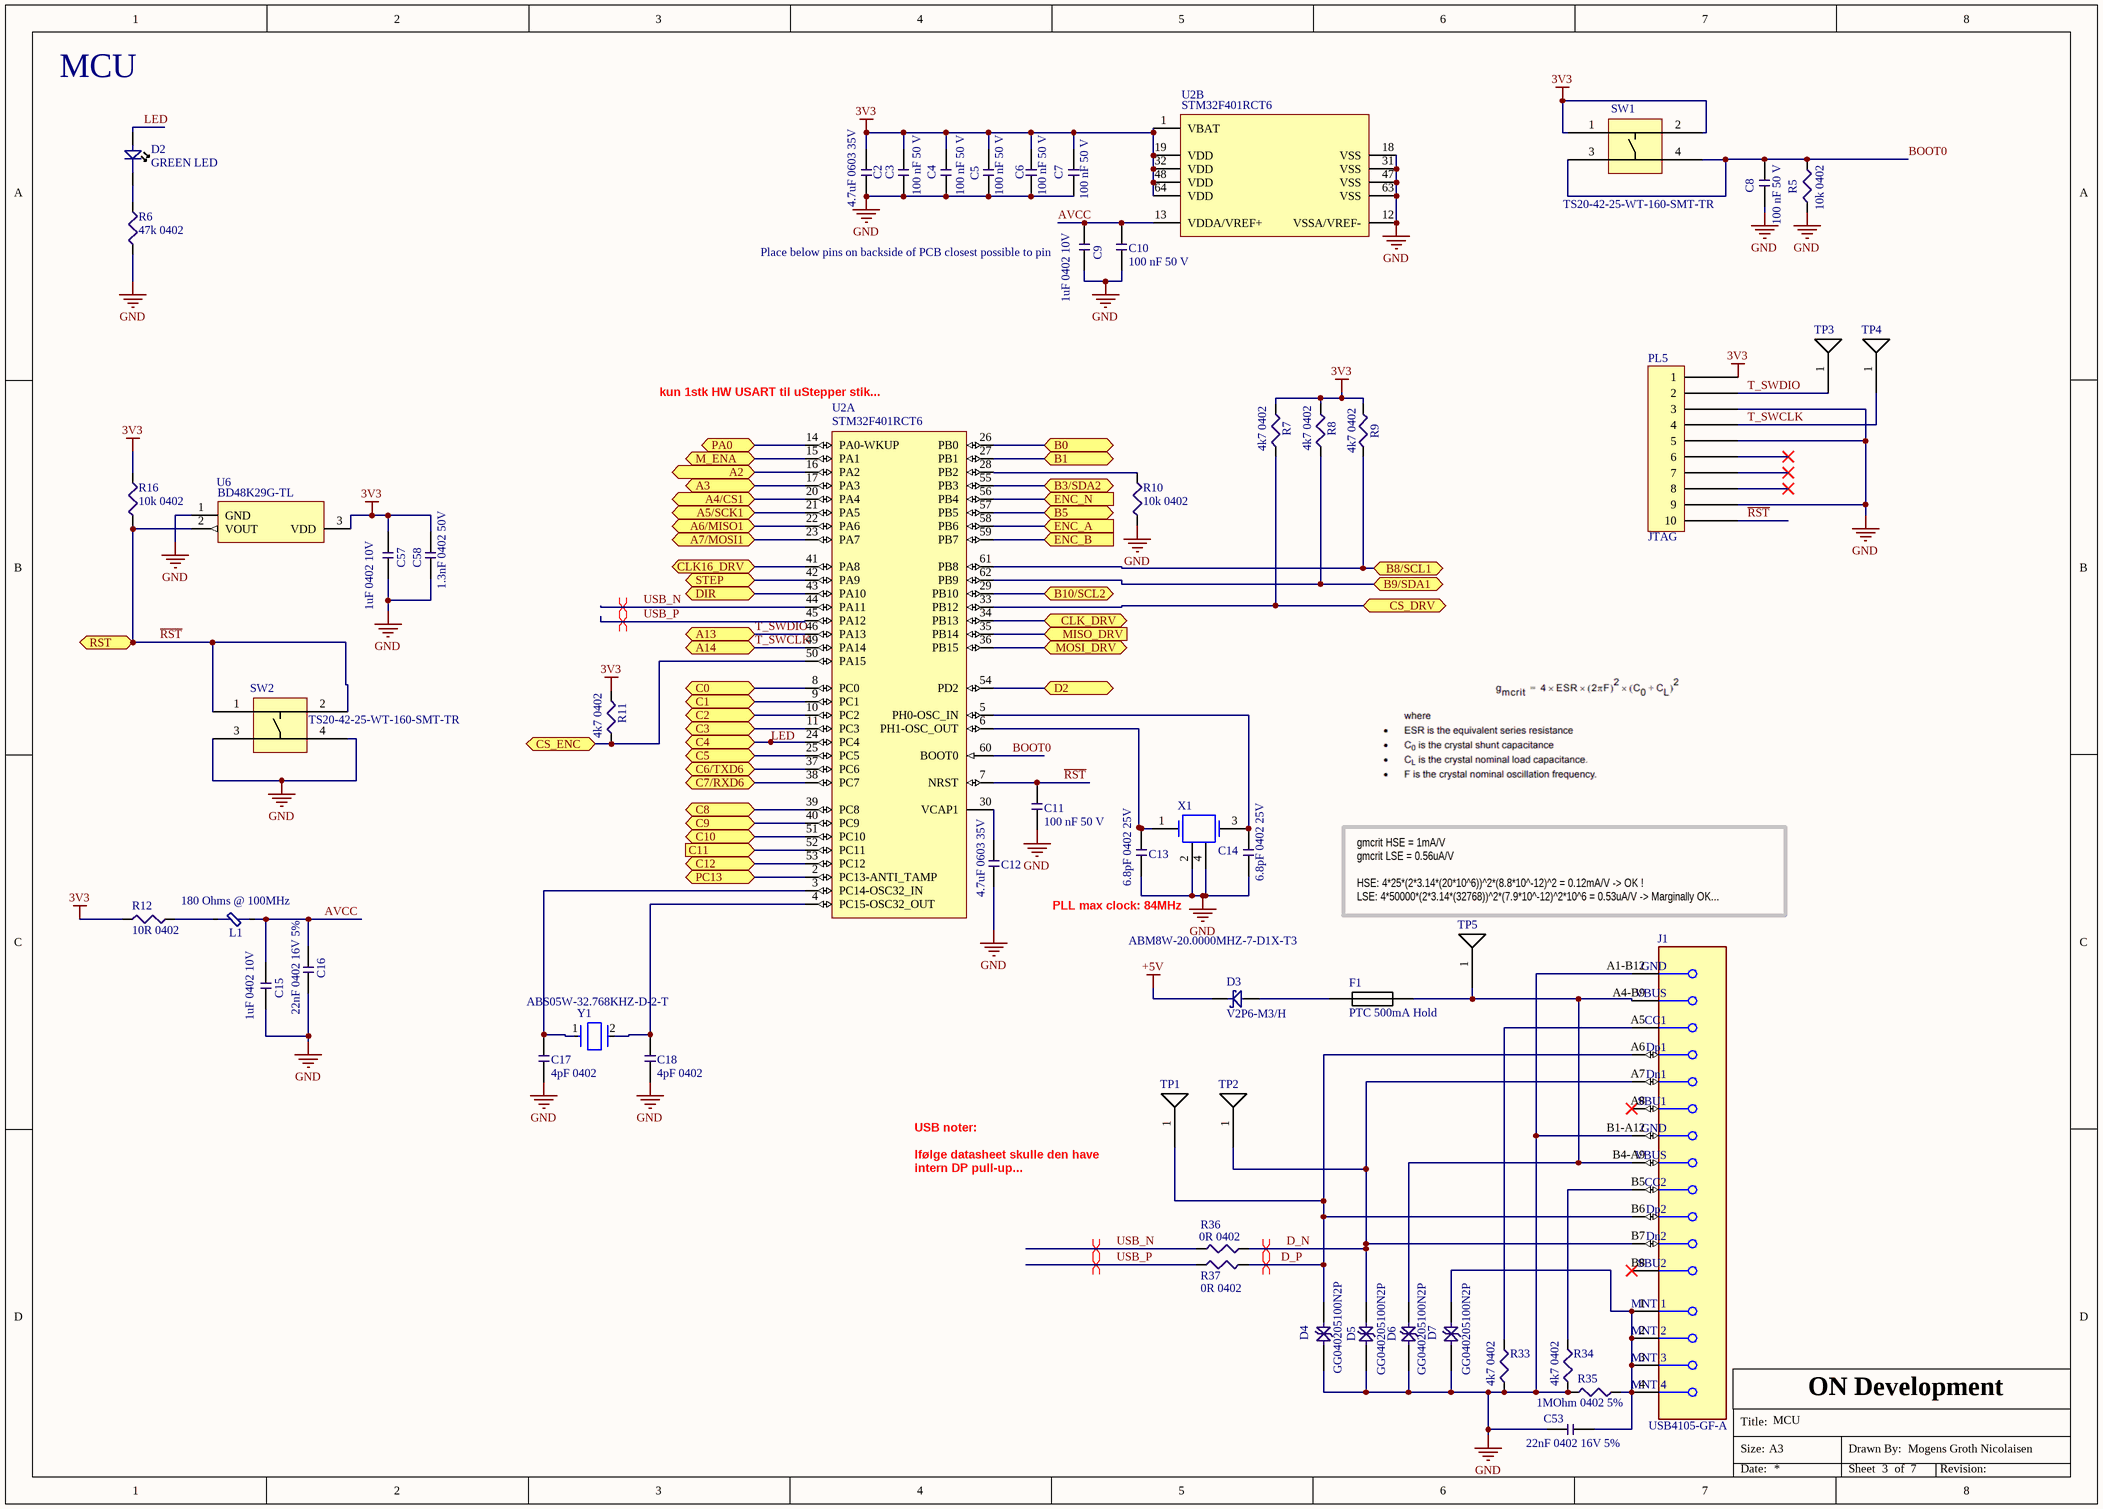
[diagram p5: MCU+IO.SchDoc]

### Parts
C2  4.7uF 0603 35V  [CAP_0603]
C3  100 nF 50 V  [CAP_0402]
C4  100 nF 50 V  [CAP_0402]
C5  100 nF 50 V  [CAP_0402]
C6  100 nF 50 V  [CAP_0402]
C7  100 nF 50 V  [CAP_0402]
C8  100 nF 50 V  [CAP_0402]
C9  1uF 0402 10V  [CAP_0402]
C10  100 nF 50 V  [CAP_0402]
C11  100 nF 50 V  [CAP_0402]
C12  4.7uF 0603 35V  [CAP_0603]
C13  6.8pF 0402 25V  [CAP_0402]
C14  6.8pF 0402 25V  [CAP_0402]
C15  1uF 0402 10V  [CAP_0402]
C16  22nF 0402 16V 5%  [CAP_0402]
C17  4pF 0402  [CAP_0402]
C18  4pF 0402  [CAP_0402]
C53  22nF 0402 16V 5%  [CAP_0402]
C57  1uF 0402 10V  [CAP_0402]
C58  1.3nF 0402 50V  [CAP_0402]
D2  GREEN LED  [0402 LED]
D3  V2P6-M3/H  [MicroSMP]
D4  Mfg. Part Number: GG040205100N2P  [RES_0402]  (hidden comment: TVS)
D5  Mfg. Part Number: GG040205100N2P  [RES_0402]  (hidden comment: TVS)
D6  Mfg. Part Number: GG040205100N2P  [RES_0402]  (hidden comment: TVS)
D7  Mfg. Part Number: GG040205100N2P  [RES_0402]  (hidden comment: TVS)
F1  PTC 500mA Hold  [PTC Fuse 1206]
J1  USB4105-GF-A  [FP-USB4105-GF-A-MFG]
L1  180 Ohms @ 100MHz  [IND_0603]
PL5  JTAG  [FP-62101021021-MFG]
R5  10k 0402  [RES_0402]
R6  47k 0402  [RES_0402]
R7  4k7 0402  [RES_0402]
R8  4k7 0402  [RES_0402]
R9  4k7 0402  [RES_0402]
R10  10k 0402  [RES_0402]
R11  4k7 0402  [RES_0402]
R12  10R 0402  [RES_0402]
R16  10k 0402  [RES_0402]
R33  4k7 0402  [RES_0402]
R34  4k7 0402  [RES_0402]
R35  1MOhm 0402 5%  [RES_0402]
R36  0R 0402  [RES_0402]
R37  0R 0402  [RES_0402]
SW1  TS20-42-25-WT-160-SMT-TR  [TS20-42-25-WT-160-SMT-TR-Footprint-1]
SW2  TS20-42-25-WT-160-SMT-TR  [TS20-42-25-WT-160-SMT-TR-Footprint-1]
TP1  TestPoint  [1x0mm]  (value not drawn)  (no BOM)
TP2  TestPoint  [1x0mm]  (value not drawn)  (no BOM)
TP3  TestPoint  [1x0mm]  (value not drawn)  (no BOM)
TP4  TestPoint  [1x0mm]  (value not drawn)  (no BOM)
TP5  TestPoint  [1x0mm]  (value not drawn)  (no BOM)
U2  STM32F401RCT6  [STM-LQFP64_M]  (parts A,B of 2)
U6  Manufacturer part no.:: BD48K29G-TL  [SOT95P282X125-3N]  (hidden comment: Supervisor)
X1  ABM8W-20.0000MHZ-7-D1X-T3  [3.2x2.5mm 4pin xtal]
Y1  ABS05W-32.768KHZ-D-2-T  [FP-ABS05W-MFG]

### Ports
A2 (bidir), A3 (bidir), A4/CS1 (bidir), A5/SCK1 (bidir), A6/MISO1 (bidir), A7/MOSI1 (bidir), A13 (bidir), A14 (bidir), B0 (bidir), B1 (bidir), B3/SDA2 (bidir), B5 (bidir), B8/SCL1 (bidir), B9/SDA1 (bidir), B10/SCL2 (bidir), C0 (bidir), C1 (bidir), C2 (bidir), C3 (bidir), C4 (bidir), C5 (bidir), C6/TXD6 (bidir), C7/RXD6 (bidir), C8 (bidir), C9 (bidir), C10 (bidir), C11 (in), C12 (bidir), CLK16_DRV (bidir), CLK_DRV (bidir), CS_DRV (bidir), CS_ENC (bidir), D2 (bidir), DIR (bidir), ENC_A (in), ENC_B (in), ENC_N (in), M_ENA (bidir), MISO_DRV (in), MOSI_DRV (bidir), PA0 (bidir), PC13 (bidir), RST (bidir), STEP (bidir)

### Nets
3V3: C2.2 C3.2 C4.2 C5.2 C6.2 C7.2 C57.2 C58.2 PL5.1 R7.2 R8.2 R9.2 R11.2 R12.1 R16.2 SW1.1 SW1.2 U2.1(VBAT) U2.19(VDD) U2.32(VDD) U2.48(VDD) U2.64(VDD) U6.3(VDD)
+5V: D3.2
GND: C2.1 C3.1 C4.1 C5.1 C6.1 C7.1 C8.1 C9.1 C10.1 C11.1 C12.1 C13.1 C14.1 C15.1 C16.1 C17.1 C18.1 C53.1 C57.1 C58.1 D4.1(Anode) D5.1(Anode) D6.1(Anode) D7.1(Anode) J1.A1-B12(GND) J1.B1-A12(GND) PL5.3 PL5.5 PL5.9 R5.1 R6.1 R10.1 R33.1 R34.1 R35.1 SW2.3 SW2.4 U2.12(VSSA/VREF-) U2.18(VSS) U2.31(VSS) U2.47(VSS) U2.63(VSS) U6.1(GND) X1.2(OSC2) X1.4(OSC2)
~{RST}: C11.2 PL5.10 R16.1 SW2.1 SW2.2 U2.7(NRST) U6.2(VOUT) ; port RST
AIN_TMC: U2.14(PA0-WKUP) ; port PA0
AVCC: C9.2 C10.2 C15.2 C16.2 L1.2 U2.13(VDDA/VREF+)
B0: U2.26(PB0) ; port B0
B1: U2.27(PB1) ; port B1
B5: U2.57(PB5) ; port B5
BOOT0: C8.2 R5.2 SW1.3 SW1.4 U2.60(BOOT0)
C2: U2.10(PC2) ; port C2
C3: U2.11(PC3) ; port C3
C5: U2.25(PC5) ; port C5
C9: U2.40(PC9) ; port C9
CLK_16: U2.41(PA8) ; port CLK16_DRV
CLK_DRV: U2.34(PB13) ; port CLK_DRV
CLK_ENC: U2.51(PC10) ; port C10
CS_DRV: R7.1 U2.33(PB12) ; port CS_DRV
CS_DRV2: U2.8(PC0) ; port C0
CS_ENC: R11.1 U2.50(PA15) ; port CS_ENC
D0/RXD: U2.38(PC7) ; port C7/RXD6
D1/TXD: U2.37(PC6) ; port C6/TXD6
D2/MOSI1: U2.23(PA7) ; port A7/MOSI1
D3/MISO1: U2.22(PA6) ; port A6/MISO1
D4/TX2: U2.16(PA2) ; port A2
D5/RX2: U2.17(PA3) ; port A3
D6/SCK1: U2.21(PA5) ; port A5/SCK1
D7/SCL1: R9.1 U2.61(PB8) ; port B8/SCL1
D8/SDA1: R8.1 U2.62(PB9) ; port B9/SDA1
D9/CS1: U2.20(PA4) ; port A4/CS1
D10/SDA0: U2.55(PB3) ; port B3/SDA2
D11/SCL0: U2.29(PB10) ; port B10/SCL2
D_N: D5.2(Cathode) J1.A7(Dn1) J1.B7(Dn2) R36.2 TP2.1
D_P: D4.2(Cathode) J1.A6(Dp1) J1.B6(Dp2) R37.2 TP1.1
DRV_DIR: U2.43(PA10) ; port DIR
DRV_ENA: U2.15(PA1) ; port M_ENA
DRV_STP: U2.42(PA9) ; port STEP
ENC_A: U2.58(PB6) ; port ENC_A
ENC_B: U2.59(PB7) ; port ENC_B
ENC_N: U2.56(PB4) ; port ENC_N
LED: D2.1 U2.24(PC4) ; port C4  [project net C4]
MISO_DRV: U2.35(PB14) ; port MISO_DRV
MISO_ENC: U2.52(PC11) ; port C11
MOSI_DRV: U2.36(PB15) ; port MOSI_DRV
MOSI_ENC: U2.53(PC12) ; port C12
PC13: U2.2(PC13-ANTI_TAMP) ; port PC13
PD2: U2.54(PD2) ; port D2
SD_MD: U2.39(PC8) ; port C8
SPI_MD: U2.9(PC1) ; port C1
T_SWCLK: PL5.4 TP4.1 U2.49(PA14) ; port A14  [project net A14]
T_SWDIO: PL5.2 TP3.1 U2.46(PA13) ; port A13  [project net A13]
USB_N: R36.1 U2.44(PA11)
USB_P: R37.1 U2.45(PA12)
NetC12_2: C12.2 U2.30(VCAP1)
NetC13_2: C13.2 U2.6(PH1-OSC_OUT) X1.1(OSC1)
NetC14_2: C14.2 U2.5(PH0-OSC_IN) X1.3(OSC2)
NetC17_2: C17.2 U2.3(PC14-OSC32_IN) Y1.1
NetC18_2: C18.2 U2.4(PC15-OSC32_OUT) Y1.2
NetC53_2: C53.2 D7.2(Cathode) J1.1(MNT_1) J1.2(MNT_2) J1.3(MNT_3) J1.4(MNT_4) R35.2
NetD2_2: D2.2 R6.2
NetD3_1: D3.1 F1.1
NetD6_2: D6.2(Cathode) F1.2 J1.A4-B9(VBUS) J1.B4-A9(VBUS) TP5.1
NetJ1_A5: J1.A5(CC1) R33.2
NetJ1_B5: J1.B5(CC2) R34.2
NetL1_1: L1.1 R12.2
NetR10_2: R10.2 U2.28(PB2)

Not connected (* = marked no-connect by the designer): J1 A8(SBU1)* B8(SBU2)*; PL5 6* 7* 8*

### Layout directives
differential pair: D_N, D_P, USB_N, USB_P

### Notes on the sheet
- Place below pins on backside of PCB closest possible to pin
- (near U2) kun 1stk HW USART til uStepper stik...
- PLL max clock: 84MHz
- (near TP5) gmcrit HSE = 1mA/V
  gmcrit LSE = 0.56uA/V
  HSE: 4*25*(2*3.14*(20*10^6))^2*(8.8*10^-12)^2 = 0.12mA/V -> OK !
  LSE: 4*50000*(2*3.14*(32768))^2*(7.9*10^-12)^2*10^6 = 0.53uA/V -> Marginally OK...
- (near TP1) USB noter:
  Ifølge datasheet skulle den have intern DP pull-up...
- ON Development
- Title:
- Size:
- A3
- Drawn By:
- Date:
- Sheet
- of
- Revision:

### Library data of the parts
C2 C12 = CMP-00134-0.1: as C26 on sheet Power; Tolerance: 10%; Capacitance: 4.7uF; Case/Package: 0603; Case Code (Imperial): 0603; Case Code (Metric): 1608; Max Operating Temperature: 85°C; Min Operating Temperature: -55°C; Packaging: Tape and Reel; Series: C; Termination: SMD/SMT; Voltage Rating: 35V
C3-C8 C10 C11 = CMP-00088-2: as C19 on sheet Power; Mount: Surface Mount; Case/Package: 0402; Case Code (Imperial): 0402; Case Code (Metric): 1005; Min Operating Temperature: -55°C; Max Operating Temperature: 125°C; Capacitance: 100nF; Voltage Rating (DC): 50V; Packaging: Tape and Reel; Package Quantity: 10000; Dielectric: X7R; Termination: SMD/SMT; Length: 0.039inch; Height: 0.5mm; Width: 0.5mm; Thickness: 0.022inch; Lead Free: Lead Free; Halogen Free: Halogen Free
C9 C15 C57 = CMP-00032-5: 1uF 0402 10V 10% X5R; Material: Ceramic; Tolerance: 10%; Value: 1 uF; Voltage: 10 V; Capacitance: 1uF; Case/Package: 0402; Case Code (Imperial): 0402; Case Code (Metric): 1005; Contact Plating: Tin; Depth: 0.5mm; Dielectric: X5R; Height: 0.5mm; Length: 1mm; Max Operating Temperature: 85°C; Min Operating Temperature: -55°C; Mount: Surface Mount; Package Quantity: 1; Packaging: Tape and Reel; Radiation Hardening: No; Thickness: 0.022inch; Voltage Rating: 10V; Width: 0.02inch
C13 C14 = CMP-00154-2: Multilayer Ceramic Capacitors MLCC - SMD/SMT 0402 6.8pF 25volts C0G +/-0.25pF; Manufacturer Part No.: GRM1555C1E6R8CA01D; Value: 6.8pF; Voltage: 25V
C16 C53 = CMP-00176-1: as C45 on sheet Stepper_control; Tolerance: 5%; Value: 22nF; Voltage: 16V
C17 C18 = CMP-00172-2: GJM1555C1HR40BB01D ; Rohs; Murata ; Cap Ceramic 0.4PF 50V C0G 0402; Tolerance: 0.1pF; Value: 4pF; Voltage: 50V; Manufacturer Part No: GJM1555C1HR40BB01D
C58 = CMP-00174-1: as C34 on sheet Power; Value: 1.3nF; Voltage: 50V
D2 = CMP-008-0001-2: as D8 on sheet Power
D3 = CMP-016-0002-2: DIODE SCHOTTKY 60V 2A MICROSMP
D4-D7 = CMP-016-0004-2: TVS DIODE 12VC 8A IPP 0402
F1 = CMP-017-0001-1: PTC RESET FUSE 8V 500MA 1206; Mfg. Part Number: 0ZCJ0050FF2G; Case/Package: 1206; Mount: SMD; Pins: 2; RoHS: Yes
J1 = CMP-003-0034-0.0: Conn USB 2.0 Type C RCP 24 POS 0.3mm/0.5mm Solder RA SMD 24 Terminal 1 Port T/R; Gender: Receptacle; Mating Cycles: 10000; Number of Ports: 1; Shielding: Shielded; Connector Type: USB; Contact Plating: Gold; Flammability Rating: UL94 V-0; Insulation Color: Black; Max Operating Temperature: 85°C; Min Operating Temperature: -40°C; Mount: Surface Mount,Through Hole,Horizontal; Series: USB4105; Termination: Solder
L1 = CMP-ROOT-0005-2: as L3 on sheet Stepper_control; Case/Package: 0603
PL5 = CMP-003-0036-0.2: Conn, Header, 10Pos, 2Row, 1.27Mm Rohs Compliant: Yes; Gender: Male; RoHS Compliant: Yes; Contact Material: Copper Alloy
R5 R10 R16 = CMP-001-0019-3: as R23 on sheet Power; Case/Package: 0402; Power: 1/16 W; Tolerance: 1 %; Value: 10k
R6 = CMP-001-0027-3: as R29 on sheet Stepper_control; Case/Package: 0402; Power: 1/16W; Tolerance: 1%; Value: 47k
R7-R9 R11 R33 R34 = CMP-001-0029-3: RES SMD 4.7K OHM 1% 1/16W 0402; Mfg. Part Number: RC1005F472CS; Tolerance: 1; Case/Package: 0402; Power: 1/16W; Value: 4k7
R12 = CMP-001-0033-3: as R25 on sheet Stepper_control; Case/Package: 0402; Tolerance: 1%; Value: 10R
R35 = CMP-001-0065-1: RES SMD 1M OHM 5% 1/16W 0402; Mfg. Part Number: CR0402JC1MS001; Value: 1Mega; Case/Package: 0402; Power: 1/16 W; Tolerance: 5%
R36 R37 = CMP-001-0055-1: as R2 on sheet encoder; Case/Package: 0402; Tolerance: -; Value: 0R
SW1 SW2 = CMP-013-0004-2: Tactile Switch SPST-NO Top Actuated Surface Mount; Case/Package: -; Mount: SMD; Pins: 4; RoHS: Yes; Mfg. Part No.: TS20-42-25-WT-160-SMT-TR
TP1-TP5 = CMP-ROOT-0006-0.0
U2 = CMP-ROOT-00011-1: ARM® Cortex®-M4 STM32 F4 Microcontroller IC 32-Bit 84MHz 256KB (256K x 8) FLASH; Case/Package: LQFP; Mount: SMD; RoHS: Yes; Manufacturer Part No.: STM32F401RCT6; PartId: 1
U6 = CMP-00178-1: IC DETECTOR VOLT 2.9V OD SSOP3; Case/Package: SOT23-3; Mount: SMD; Pins: 3; RoHS: Yes
X1 = CMP-ROOT-00010-2: Crystal 20MHz ±10ppm (Tol) ±20ppm (Stability) 7pF FUND 50Ohm 4-Pin SMD T/R; Case/Package: SMD/SMT; Mount: Surface Mount; RoHS: Yes; Manufacturer Part No.: ABM8W-20.0000MHZ-7-D1X-T3
Y1 = CMP-ROOT-00014-1: ABS05W IoT Optimized Crystal 32.768KHz 4pF 70K Ohm ±20ppm 2-Pin SMD T/R; Case/Package: SMD/SMT; Mount: Surface Mount; RoHS: Yes; Manufacturer Part No.: ABS05W-32.768KHZ-D-2-T

## Nets that join several sheets
3V3: Main (PL2.9), encoder (C1.1 U1.6), Power (C37.2 D8.1 U4.2), Stepper_control (C44.1 R31.1 U5.10), MCU+IO (23 pins)
+5V: Main (PL2.8), Power (14 pins), Stepper_control (R25.2), MCU+IO (D3.2)
GND: Main (11 pins), encoder (C1.2 U1.7), Power (30 pins), Stepper_control (24 pins), MCU+IO (45 pins)
VIN: Main (D1.3 PL2.4 PL2.5 PL3.2), Power (7 pins), Stepper_control (8 pins)
~{RST}: Main (PL2.10), MCU+IO (7 pins)
AIN_TMC: Stepper_control (R32.1), MCU+IO (U2.14)
B0: Main (PL4.19), MCU+IO (U2.26)
B1: Main (PL4.17), MCU+IO (U2.27)
B5: Main (PL4.4), MCU+IO (U2.57)
C2: Main (PL4.1), MCU+IO (U2.10)
C3: Main (PL4.9), MCU+IO (U2.11)
C4: Main (PL4.20), MCU+IO (D2.1 U2.24)
C5: Main (PL4.15), MCU+IO (U2.25)
C9: Main (PL4.5), MCU+IO (U2.40)
CLK_16: Stepper_control (U5.2), MCU+IO (U2.41)
CLK_DRV: Main (PL4.14), Stepper_control (U5.4), MCU+IO (U2.34)
CLK_ENC: encoder (R1.1), MCU+IO (U2.51)
CS_DRV: Stepper_control (U5.3), MCU+IO (R7.1 U2.33)
CS_DRV2: Main (PL4.3), MCU+IO (U2.8)
CS_ENC: encoder (R4.1), MCU+IO (R11.1 U2.50)
D0/RXD: Main (PL1.1), MCU+IO (U2.38)
D1/TXD: Main (PL1.2), MCU+IO (U2.37)
D2/MOSI1: Main (PL1.3), MCU+IO (U2.23)
D3/MISO1: Main (PL1.4), MCU+IO (U2.22)
D4/TX2: Main (PL1.5), MCU+IO (U2.16)
D5/RX2: Main (PL1.6), MCU+IO (U2.17)
D6/SCK1: Main (PL1.7), MCU+IO (U2.21)
D7/SCL1: Main (PL1.8), MCU+IO (R9.1 U2.61)
D8/SDA1: Main (PL1.9), MCU+IO (R8.1 U2.62)
D9/CS1: Main (PL2.1), MCU+IO (U2.20)
D10/SDA0: Main (PL2.2), MCU+IO (U2.55)
D11/SCL0: Main (PL2.3), MCU+IO (U2.29)
DRV_DIR: Stepper_control (U5.9), MCU+IO (U2.43)
DRV_ENA: Stepper_control (U5.29), MCU+IO (U2.15)
DRV_STP: Stepper_control (U5.8), MCU+IO (U2.42)
ENC_A: encoder (U1.5), Stepper_control (U5.25), MCU+IO (U2.58)
ENC_B: encoder (U1.8), Stepper_control (U5.24), MCU+IO (U2.59)
ENC_N: encoder (U1.1), Stepper_control (U5.23), MCU+IO (U2.56)
MISO_DRV: Main (PL4.13), Stepper_control (U5.7), MCU+IO (U2.35)
MISO_ENC: encoder (R2.1 R3.1), MCU+IO (U2.52)
MOSI_DRV: Main (PL4.12), Stepper_control (U5.5), MCU+IO (U2.36)
MOSI_ENC: encoder (R2.2), MCU+IO (U2.53)
PC13: Main (PL4.11), MCU+IO (U2.2)
PD2: Main (PL4.2), MCU+IO (U2.54)
SD_MD: Stepper_control (U5.11), MCU+IO (U2.39)
SPI_MD: Stepper_control (U5.12), MCU+IO (U2.9)

## Assembly variants
Default: not fitted PL5 R32 R?